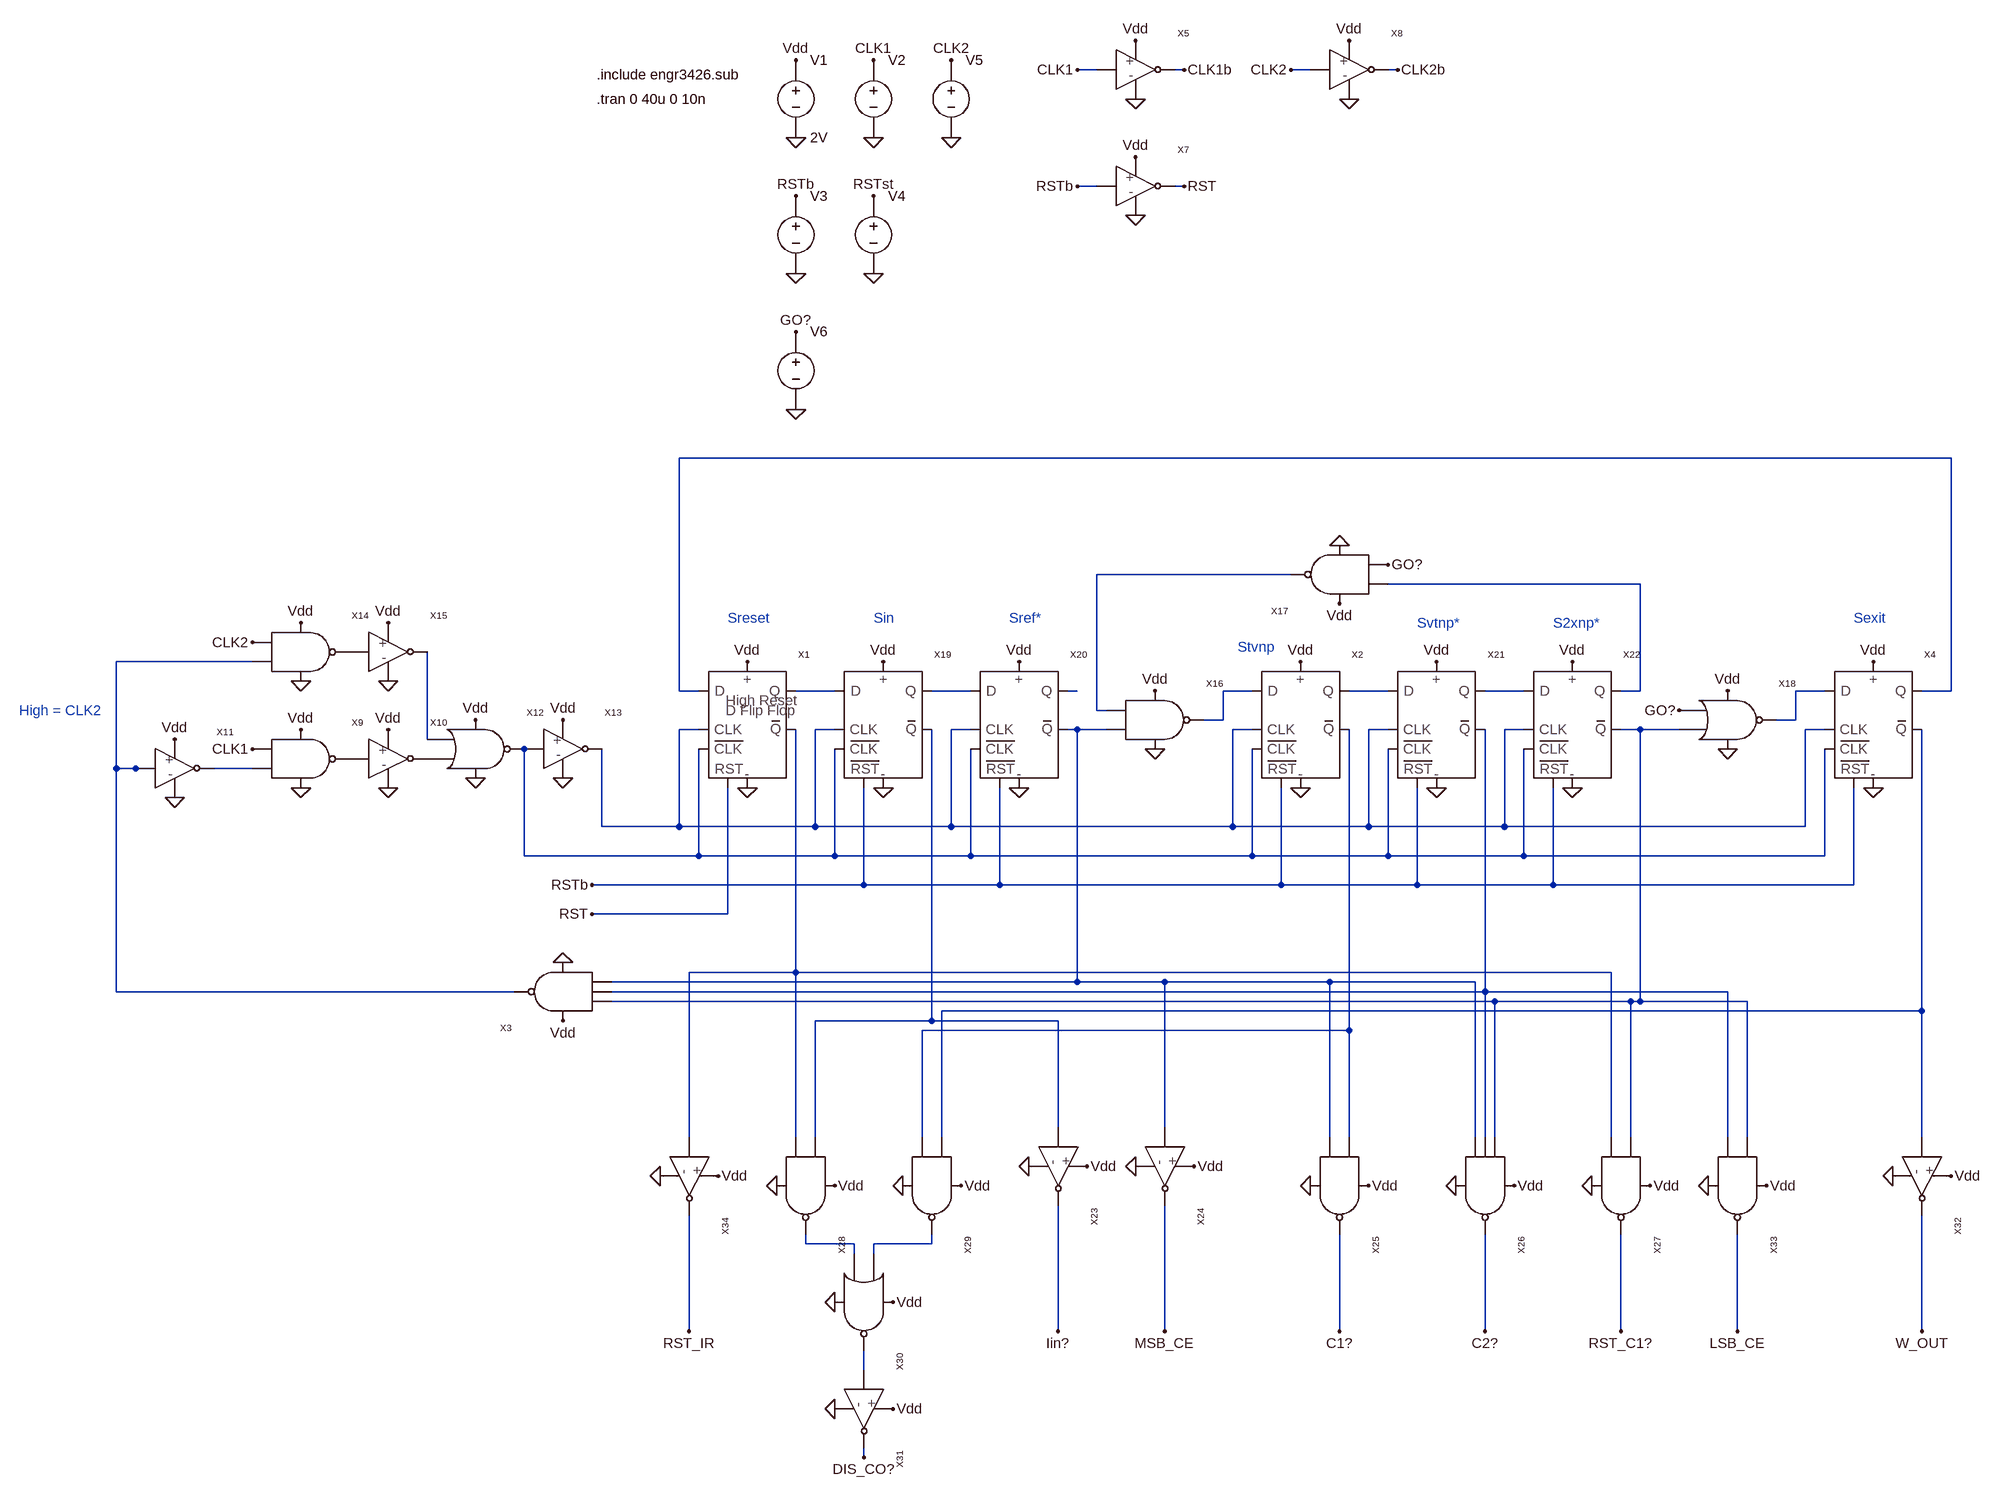
[diagram p0: schematic state_machine_test.asc]
state_machine_test.asc, the LTspice schematic file:
Version 4
SHEET 1 2148 2176
WIRE 352 -272 320 -272
WIRE 496 -272 480 -272
WIRE 704 -272 672 -272
WIRE 848 -272 832 -272
WIRE 352 -80 320 -80
WIRE 496 -80 480 -80
WIRE 1760 368 -336 368
WIRE 672 560 352 560
WIRE 1248 576 832 576
WIRE -1040 704 -1264 704
WIRE -336 752 -336 368
WIRE -304 752 -336 752
WIRE -80 752 -144 752
WIRE 144 752 80 752
WIRE 320 752 304 752
WIRE 608 752 560 752
WIRE 832 752 768 752
WIRE 1056 752 992 752
WIRE 1248 752 1248 576
WIRE 1248 752 1216 752
WIRE 1552 752 1504 752
WIRE 1760 752 1760 368
WIRE 1760 752 1712 752
WIRE 352 784 352 560
WIRE 368 784 352 784
WIRE 560 800 560 752
WIRE 560 800 528 800
WIRE 1504 800 1504 752
WIRE 1504 800 1472 800
WIRE -304 816 -336 816
WIRE -80 816 -112 816
WIRE 144 816 112 816
WIRE 320 816 304 816
WIRE 368 816 320 816
WIRE 608 816 576 816
WIRE 832 816 800 816
WIRE 1056 816 1024 816
WIRE 1248 816 1216 816
WIRE 1312 816 1248 816
WIRE 1552 816 1520 816
WIRE -752 832 -752 688
WIRE -1264 880 -1264 704
WIRE -1232 880 -1264 880
WIRE -1216 880 -1232 880
WIRE -1040 880 -1104 880
WIRE -464 976 -464 848
WIRE -336 976 -336 816
WIRE -336 976 -464 976
WIRE -112 976 -112 816
WIRE -112 976 -336 976
WIRE 112 976 112 816
WIRE 112 976 -112 976
WIRE 576 976 576 816
WIRE 576 976 112 976
WIRE 800 976 800 816
WIRE 800 976 576 976
WIRE 1024 976 1024 816
WIRE 1024 976 800 976
WIRE 1520 976 1520 816
WIRE 1520 976 1024 976
WIRE -592 1024 -592 848
WIRE -304 1024 -304 848
WIRE -304 1024 -592 1024
WIRE -80 1024 -80 848
WIRE -80 1024 -304 1024
WIRE 144 1024 144 848
WIRE 144 1024 -80 1024
WIRE 608 1024 608 848
WIRE 608 1024 144 1024
WIRE 832 1024 832 848
WIRE 832 1024 608 1024
WIRE 1056 1024 1056 848
WIRE 1056 1024 832 1024
WIRE 1552 1024 1552 848
WIRE 1552 1024 1056 1024
WIRE -32 1072 -32 912
WIRE -32 1072 -480 1072
WIRE 192 1072 192 912
WIRE 192 1072 -32 1072
WIRE 656 1072 656 912
WIRE 656 1072 192 1072
WIRE 880 1072 880 912
WIRE 880 1072 656 1072
WIRE 1104 1072 1104 912
WIRE 1104 1072 880 1072
WIRE 1600 1072 1600 912
WIRE 1600 1072 1104 1072
WIRE -256 1120 -256 912
WIRE -256 1120 -480 1120
WIRE -144 1216 -144 816
WIRE -144 1216 -320 1216
WIRE 1200 1216 -144 1216
WIRE 320 1232 320 816
WIRE 320 1232 -448 1232
WIRE 464 1232 320 1232
WIRE 736 1232 464 1232
WIRE 976 1232 736 1232
WIRE -1264 1248 -1264 880
WIRE -608 1248 -1264 1248
WIRE 992 1248 992 816
WIRE 992 1248 -448 1248
WIRE 1392 1248 992 1248
WIRE 1008 1264 -448 1264
WIRE 1232 1264 1008 1264
WIRE 1248 1264 1248 816
WIRE 1248 1264 1232 1264
WIRE 1424 1264 1248 1264
WIRE 1712 1280 1712 816
WIRE 1712 1280 96 1280
WIRE 80 1296 80 816
WIRE 80 1296 -112 1296
WIRE 288 1296 80 1296
WIRE 768 1312 768 816
WIRE 768 1312 64 1312
WIRE 288 1472 288 1296
WIRE 464 1472 464 1232
WIRE -320 1488 -320 1216
WIRE -144 1488 -144 1216
WIRE -112 1488 -112 1296
WIRE 64 1488 64 1312
WIRE 96 1488 96 1280
WIRE 736 1488 736 1232
WIRE 768 1488 768 1312
WIRE 976 1488 976 1232
WIRE 992 1488 992 1248
WIRE 1008 1488 1008 1264
WIRE 1200 1488 1200 1216
WIRE 1232 1488 1232 1264
WIRE 1392 1488 1392 1248
WIRE 1424 1488 1424 1264
WIRE 1712 1488 1712 1280
WIRE -128 1664 -128 1648
WIRE -48 1664 -128 1664
WIRE 80 1664 80 1648
WIRE 80 1664 -16 1664
WIRE -48 1680 -48 1664
WIRE -16 1680 -16 1664
WIRE -320 1808 -320 1616
WIRE 288 1808 288 1600
WIRE 464 1808 464 1600
WIRE 752 1808 752 1648
WIRE 992 1808 992 1648
WIRE 1216 1808 1216 1648
WIRE 1408 1808 1408 1648
WIRE 1712 1808 1712 1616
WIRE -32 1872 -32 1840
WIRE -32 2016 -32 2000
FLAG 416 -224 0
FLAG 416 -320 Vdd
FLAG 320 -272 CLK1
FLAG 496 -272 CLK1b
FLAG -16 -288 CLK1
FLAG -16 -160 0
FLAG -144 -160 0
FLAG -224 912 0
FLAG 688 912 0
FLAG 1632 912 0
FLAG -144 -288 Vdd
FLAG -224 704 Vdd
FLAG 688 704 Vdd
FLAG 1632 704 Vdd
FLAG -144 64 0
FLAG -144 -64 RSTb
FLAG -480 1072 RSTb
FLAG -16 64 0
FLAG -16 -64 RSTst
FLAG 416 -32 0
FLAG 416 -128 Vdd
FLAG 112 -288 CLK2
FLAG 112 -160 0
FLAG 768 -224 0
FLAG 768 -320 Vdd
FLAG 672 -272 CLK2
FLAG 848 -272 CLK2b
FLAG -1040 848 CLK1
FLAG -1168 928 0
FLAG -960 912 0
FLAG -816 912 0
FLAG -816 816 Vdd
FLAG -960 816 Vdd
FLAG -1168 832 Vdd
FLAG -672 896 0
FLAG -528 896 0
FLAG -672 800 Vdd
FLAG -528 800 Vdd
FLAG -1040 672 CLK2
FLAG -960 736 0
FLAG -816 736 0
FLAG -816 640 Vdd
FLAG -960 640 Vdd
FLAG -144 288 0
FLAG -144 160 GO?
FLAG 832 544 GO?
FLAG 448 848 0
FLAG 752 512 0
FLAG 448 752 Vdd
FLAG 752 608 Vdd
FLAG 1312 784 GO?
FLAG 1392 848 0
FLAG 1392 752 Vdd
FLAG 0 912 0
FLAG 0 704 Vdd
FLAG 224 912 0
FLAG 224 704 Vdd
FLAG 912 912 0
FLAG 912 704 Vdd
FLAG 1136 912 0
FLAG 1136 704 Vdd
FLAG -528 1200 0
FLAG -528 1296 Vdd
FLAG 336 1536 Vdd
FLAG 240 1536 0
FLAG 288 1808 Iin?
FLAG 800 1568 Vdd
FLAG 704 1568 0
FLAG 752 1808 C1?
FLAG 1040 1568 Vdd
FLAG 944 1568 0
FLAG 992 1808 C2?
FLAG -176 1568 0
FLAG 32 1568 0
FLAG -80 1568 Vdd
FLAG 128 1568 Vdd
FLAG -32 2016 DIS_CO?
FLAG -80 1760 0
FLAG -80 1936 0
FLAG 16 1760 Vdd
FLAG 16 1936 Vdd
FLAG 1264 1568 Vdd
FLAG 1168 1568 0
FLAG 1216 1808 RST_C1?
FLAG 512 1536 Vdd
FLAG 416 1536 0
FLAG 464 1808 MSB_CE
FLAG 1760 1552 Vdd
FLAG 1664 1552 0
FLAG 1712 1808 W_OUT
FLAG 1456 1568 Vdd
FLAG 1360 1568 0
FLAG 1408 1808 LSB_CE
FLAG -272 1552 Vdd
FLAG -368 1552 0
FLAG -320 1808 RST_IR
FLAG -480 1120 RST
FLAG 320 -80 RSTb
FLAG 496 -80 RST
SYMBOL FlipFlop 688 816 R0
SYMATTR InstName X2
SYMATTR SpiceLine nmosL=0.9u nmosW=3u pmosL=0.9u pmosW=6u
SYMBOL FlipFlop 1632 816 R0
SYMATTR InstName X4
SYMATTR SpiceLine nmosL=0.9u nmosW=3u pmosL=0.9u pmosW=6u
SYMBOL cktsym\\vsource -144 -224 R0
WINDOW 123 0 0 Left 2
WINDOW 39 0 0 Left 2
SYMATTR Value 2V
SYMATTR InstName V1
SYMBOL Inverter 416 -272 R0
SYMATTR InstName X5
SYMATTR SpiceLine nmosL=0.9u nmosW=3u pmosL=0.9u pmosW=6u
SYMBOL cktsym\\vsource -16 -224 R0
WINDOW 3 48 12 Invisible 2
WINDOW 123 0 0 Left 2
WINDOW 39 0 0 Left 2
SYMATTR Value PULSE(0 2 .2u 1n 1n 1u 2u 20)
SYMATTR InstName V2
SYMBOL cktsym\\vsource -144 0 R0
WINDOW 3 48 16 Invisible 2
WINDOW 123 0 0 Left 2
WINDOW 39 0 0 Left 2
SYMATTR Value PWL(0 0 300n 0 325n 2 40u 2)
SYMATTR InstName V3
SYMBOL cktsym\\vsource -16 0 R0
WINDOW 3 48 16 Invisible 2
WINDOW 123 0 0 Left 2
WINDOW 39 0 0 Left 2
SYMATTR Value PWL(0 0 1.5u 0 1.55u 2 40u 2)
SYMATTR InstName V4
SYMBOL Inverter 416 -80 R0
SYMATTR InstName X7
SYMATTR SpiceLine nmosL=0.9u nmosW=3u pmosL=0.9u pmosW=6u
SYMBOL cktsym\\vsource 112 -224 R0
WINDOW 3 48 12 Invisible 2
WINDOW 123 0 0 Left 2
WINDOW 39 0 0 Left 2
SYMATTR Value PULSE(0 2 .2u 1n 1n 2u 4u 12)
SYMATTR InstName V5
SYMBOL Inverter 768 -272 R0
SYMATTR InstName X8
SYMATTR SpiceLine nmosL=0.9u nmosW=3u pmosL=0.9u pmosW=6u
SYMBOL NAND -960 864 R0
SYMATTR InstName X9
SYMATTR SpiceLine nmosL=0.9u nmosW=3u pmosL=0.9u pmosW=6u
SYMBOL Inverter -816 864 R0
SYMATTR InstName X10
SYMATTR SpiceLine nmosL=0.9u nmosW=3u pmosL=0.9u pmosW=6u
SYMBOL Inverter -1168 880 R0
SYMATTR InstName X11
SYMATTR SpiceLine nmosL=0.9u nmosW=3u pmosL=0.9u pmosW=6u
SYMBOL NOR -672 848 R0
SYMATTR InstName X12
SYMATTR SpiceLine nmosL=0.9u nmosW=3u pmosL=0.9u pmosW=6u
SYMBOL Inverter -528 848 R0
SYMATTR InstName X13
SYMATTR SpiceLine nmosL=0.9u nmosW=3u pmosL=0.9u pmosW=6u
SYMBOL NAND -960 688 R0
SYMATTR InstName X14
SYMATTR SpiceLine nmosL=0.9u nmosW=3u pmosL=0.9u pmosW=6u
SYMBOL Inverter -816 688 R0
SYMATTR InstName X15
SYMATTR SpiceLine nmosL=0.9u nmosW=3u pmosL=0.9u pmosW=6u
SYMBOL cktsym\\vsource -144 224 R0
WINDOW 3 48 16 Invisible 2
WINDOW 123 0 0 Left 2
WINDOW 39 0 0 Left 2
SYMATTR Value PWL(0 2 30u 2 30.05u 0 40u 0)
SYMATTR InstName V6
SYMBOL NAND 448 800 R0
SYMATTR InstName X16
SYMATTR SpiceLine nmosL=0.9u nmosW=3u pmosL=0.9u pmosW=6u
SYMBOL NAND 752 560 R180
SYMATTR InstName X17
SYMATTR SpiceLine nmosL=0.9u nmosW=3u pmosL=0.9u pmosW=6u
SYMBOL NOR 1392 800 R0
SYMATTR InstName X18
SYMATTR SpiceLine nmosL=0.9u nmosW=3u pmosL=0.9u pmosW=6u
SYMBOL FlipFlop 0 816 R0
SYMATTR InstName X19
SYMATTR SpiceLine nmosL=0.9u nmosW=3u pmosL=0.9u pmosW=6u
SYMBOL FlipFlop 224 816 R0
SYMATTR InstName X20
SYMATTR SpiceLine nmosL=0.9u nmosW=3u pmosL=0.9u pmosW=6u
SYMBOL FlipFlop 912 816 R0
SYMATTR InstName X21
SYMATTR SpiceLine nmosL=0.9u nmosW=3u pmosL=0.9u pmosW=6u
SYMBOL FlipFlop 1136 816 R0
SYMATTR InstName X22
SYMATTR SpiceLine nmosL=0.9u nmosW=3u pmosL=0.9u pmosW=6u
SYMBOL NAND3 -528 1248 R180
SYMATTR InstName X3
SYMATTR SpiceLine nmosL=0.9u nmosW=3u pmosL=0.9u pmosW=6u
SYMBOL Inverter 288 1536 R90
SYMATTR InstName X23
SYMATTR SpiceLine nmosL=0.9u nmosW=3u pmosL=0.9u pmosW=6u
SYMBOL NAND 752 1568 R90
SYMATTR InstName X25
SYMATTR SpiceLine nmosL=0.9u nmosW=3u pmosL=0.9u pmosW=6u
SYMBOL NAND3 992 1568 R90
SYMATTR InstName X26
SYMATTR SpiceLine nmosL=0.9u nmosW=3u pmosL=0.9u pmosW=6u
SYMBOL NAND -128 1568 R90
SYMATTR InstName X28
SYMATTR SpiceLine nmosL=0.9u nmosW=3u pmosL=0.9u pmosW=6u
SYMBOL NAND 80 1568 R90
SYMATTR InstName X29
SYMATTR SpiceLine nmosL=0.9u nmosW=3u pmosL=0.9u pmosW=6u
SYMBOL NOR -32 1760 R90
SYMATTR InstName X30
SYMATTR SpiceLine nmosL=0.9u nmosW=3u pmosL=0.9u pmosW=6u
SYMBOL Inverter -32 1936 R90
SYMATTR InstName X31
SYMATTR SpiceLine nmosL=0.9u nmosW=3u pmosL=0.9u pmosW=6u
SYMBOL NAND 1216 1568 R90
SYMATTR InstName X27
SYMATTR SpiceLine nmosL=0.9u nmosW=3u pmosL=0.9u pmosW=6u
SYMBOL Inverter 464 1536 R90
SYMATTR InstName X24
SYMATTR SpiceLine nmosL=0.9u nmosW=3u pmosL=0.9u pmosW=6u
SYMBOL Inverter 1712 1552 R90
SYMATTR InstName X32
SYMATTR SpiceLine nmosL=0.9u nmosW=3u pmosL=0.9u pmosW=6u
SYMBOL NAND 1408 1568 R90
SYMATTR InstName X33
SYMATTR SpiceLine nmosL=0.9u nmosW=3u pmosL=0.9u pmosW=6u
SYMBOL Inverter -320 1552 R90
SYMATTR InstName X34
SYMATTR SpiceLine nmosL=0.9u nmosW=3u pmosL=0.9u pmosW=6u
SYMBOL highResetFlipFlop -224 816 R0
SYMATTR InstName X1
SYMATTR SpiceLine nmosL=0.9u nmosW=3u pmosL=0.9u pmosW=6u
TEXT -472 -224 Left 2 !.tran 0 40u 0 10n
TEXT -472 -264 Left 2 !.include engr3426.sub
TEXT -256 632 Left 2 ;Sreset
TEXT -16 632 Left 2 ;Sin
TEXT 208 632 Left 2 ;Sref*
TEXT 584 680 Left 2 ;Stvnp
TEXT 880 640 Left 2 ;Svtnp*
TEXT 1104 640 Left 2 ;S2xnp*
TEXT 1600 632 Left 2 ;Sexit
TEXT -1424 784 Left 2 ;High = CLK2

The netlist it stands for:
* state_machine_test.asc
XX2 N008 N012 N017 N009 N022 RSTb Vdd 0 FlipFlop nmosL=0.9u nmosW=3u pmosL=0.9u pmosW=6u  ; pins D CLK CLKb Q Qb RESETb pos neg
XX4 N011 N012 N017 N001 N020 RSTb Vdd 0 FlipFlop nmosL=0.9u nmosW=3u pmosL=0.9u pmosW=6u  ; pins D CLK CLKb Q Qb RESETb pos neg
V1 Vdd 0 2V
XX5 CLK1 CLK1b Vdd 0 Inverter nmosL=0.9u nmosW=3u pmosL=0.9u pmosW=6u  ; pins IN OUT pos neg
V2 CLK1 0 PULSE(0 2 .2u 1n 1n 1u 2u 20)
V3 RSTb 0 PWL(0 0 300n 0 325n 2 40u 2)
V4 RSTst 0 PWL(0 0 1.5u 0 1.55u 2 40u 2)
XX7 RSTb RST Vdd 0 Inverter nmosL=0.9u nmosW=3u pmosL=0.9u pmosW=6u  ; pins IN OUT pos neg
V5 CLK2 0 PULSE(0 2 .2u 1n 1n 2u 4u 12)
XX8 CLK2 CLK2b Vdd 0 Inverter nmosL=0.9u nmosW=3u pmosL=0.9u pmosW=6u  ; pins IN OUT pos neg
XX9 CLK1 P001 N016 Vdd 0 NAND nmosL=0.9u nmosW=3u pmosL=0.9u pmosW=6u  ; pins A OUT B Vdd GROUND
XX10 P001 P002 Vdd 0 Inverter nmosL=0.9u nmosW=3u pmosL=0.9u pmosW=6u  ; pins IN OUT pos neg
XX11 N004 N016 Vdd 0 Inverter nmosL=0.9u nmosW=3u pmosL=0.9u pmosW=6u  ; pins IN OUT pos neg
XX12 N015 N017 P002 Vdd 0 NOR nmosL=0.9u nmosW=3u pmosL=0.9u pmosW=6u  ; pins A OUT B Vdd GROUND
XX13 N017 N012 Vdd 0 Inverter nmosL=0.9u nmosW=3u pmosL=0.9u pmosW=6u  ; pins IN OUT pos neg
XX14 CLK2 P003 N004 Vdd 0 NAND nmosL=0.9u nmosW=3u pmosL=0.9u pmosW=6u  ; pins A OUT B Vdd GROUND
XX15 P003 N015 Vdd 0 Inverter nmosL=0.9u nmosW=3u pmosL=0.9u pmosW=6u  ; pins IN OUT pos neg
V6 GO? 0 PWL(0 2 30u 2 30.05u 0 40u 0)
XX16 N002 N008 N013 Vdd 0 NAND nmosL=0.9u nmosW=3u pmosL=0.9u pmosW=6u  ; pins A OUT B Vdd GROUND
XX17 N003 N002 GO? Vdd 0 NAND nmosL=0.9u nmosW=3u pmosL=0.9u pmosW=6u  ; pins A OUT B Vdd GROUND
XX18 GO? N011 N014 Vdd 0 NOR nmosL=0.9u nmosW=3u pmosL=0.9u pmosW=6u  ; pins A OUT B Vdd GROUND
XX19 N005 N012 N017 N006 N021 RSTb Vdd 0 FlipFlop nmosL=0.9u nmosW=3u pmosL=0.9u pmosW=6u  ; pins D CLK CLKb Q Qb RESETb pos neg
XX20 N006 N012 N017 N007 N013 RSTb Vdd 0 FlipFlop nmosL=0.9u nmosW=3u pmosL=0.9u pmosW=6u  ; pins D CLK CLKb Q Qb RESETb pos neg
XX21 N009 N012 N017 N010 N019 RSTb Vdd 0 FlipFlop nmosL=0.9u nmosW=3u pmosL=0.9u pmosW=6u  ; pins D CLK CLKb Q Qb RESETb pos neg
XX22 N010 N012 N017 N003 N014 RSTb Vdd 0 FlipFlop nmosL=0.9u nmosW=3u pmosL=0.9u pmosW=6u  ; pins D CLK CLKb Q Qb RESETb pos neg
XX3 N014 N019 N013 Vdd 0 N004 NAND3 nmosL=0.9u nmosW=3u pmosL=0.9u pmosW=6u  ; pins A B C pos neg OUT
XX23 N021 Iin? Vdd 0 Inverter nmosL=0.9u nmosW=3u pmosL=0.9u pmosW=6u  ; pins IN OUT pos neg
XX25 N022 C1? N013 Vdd 0 NAND nmosL=0.9u nmosW=3u pmosL=0.9u pmosW=6u  ; pins A OUT B Vdd GROUND
XX26 N014 N019 N013 Vdd 0 C2? NAND3 nmosL=0.9u nmosW=3u pmosL=0.9u pmosW=6u  ; pins A B C pos neg OUT
XX28 N021 N023 N018 Vdd 0 NAND nmosL=0.9u nmosW=3u pmosL=0.9u pmosW=6u  ; pins A OUT B Vdd GROUND
XX29 N020 N024 N022 Vdd 0 NAND nmosL=0.9u nmosW=3u pmosL=0.9u pmosW=6u  ; pins A OUT B Vdd GROUND
XX30 N024 N025 N023 Vdd 0 NOR nmosL=0.9u nmosW=3u pmosL=0.9u pmosW=6u  ; pins A OUT B Vdd GROUND
XX31 N025 DIS_CO? Vdd 0 Inverter nmosL=0.9u nmosW=3u pmosL=0.9u pmosW=6u  ; pins IN OUT pos neg
XX27 N014 RST_C1? N018 Vdd 0 NAND nmosL=0.9u nmosW=3u pmosL=0.9u pmosW=6u  ; pins A OUT B Vdd GROUND
XX24 N013 MSB_CE Vdd 0 Inverter nmosL=0.9u nmosW=3u pmosL=0.9u pmosW=6u  ; pins IN OUT pos neg
XX32 N020 W_OUT Vdd 0 Inverter nmosL=0.9u nmosW=3u pmosL=0.9u pmosW=6u  ; pins IN OUT pos neg
XX33 N014 LSB_CE N019 Vdd 0 NAND nmosL=0.9u nmosW=3u pmosL=0.9u pmosW=6u  ; pins A OUT B Vdd GROUND
XX34 N018 RST_IR Vdd 0 Inverter nmosL=0.9u nmosW=3u pmosL=0.9u pmosW=6u  ; pins IN OUT pos neg
XX1 N001 N012 N017 N005 N018 RST Vdd 0 highResetFlipFlop nmosL=0.9u nmosW=3u pmosL=0.9u pmosW=6u  ; pins D CLK CLKb Q Qb RESET pos neg
.tran 0 40u 0 10n
.include engr3426.sub
* Sreset
* Sin
* Sref*
* Stvnp
* Svtnp*
* S2xnp*
* Sexit
* High = CLK2
.backanno
.end